# EAGLE design Xonik Noise A6 w.logo v2.0 (EAGLE 9.5.2)
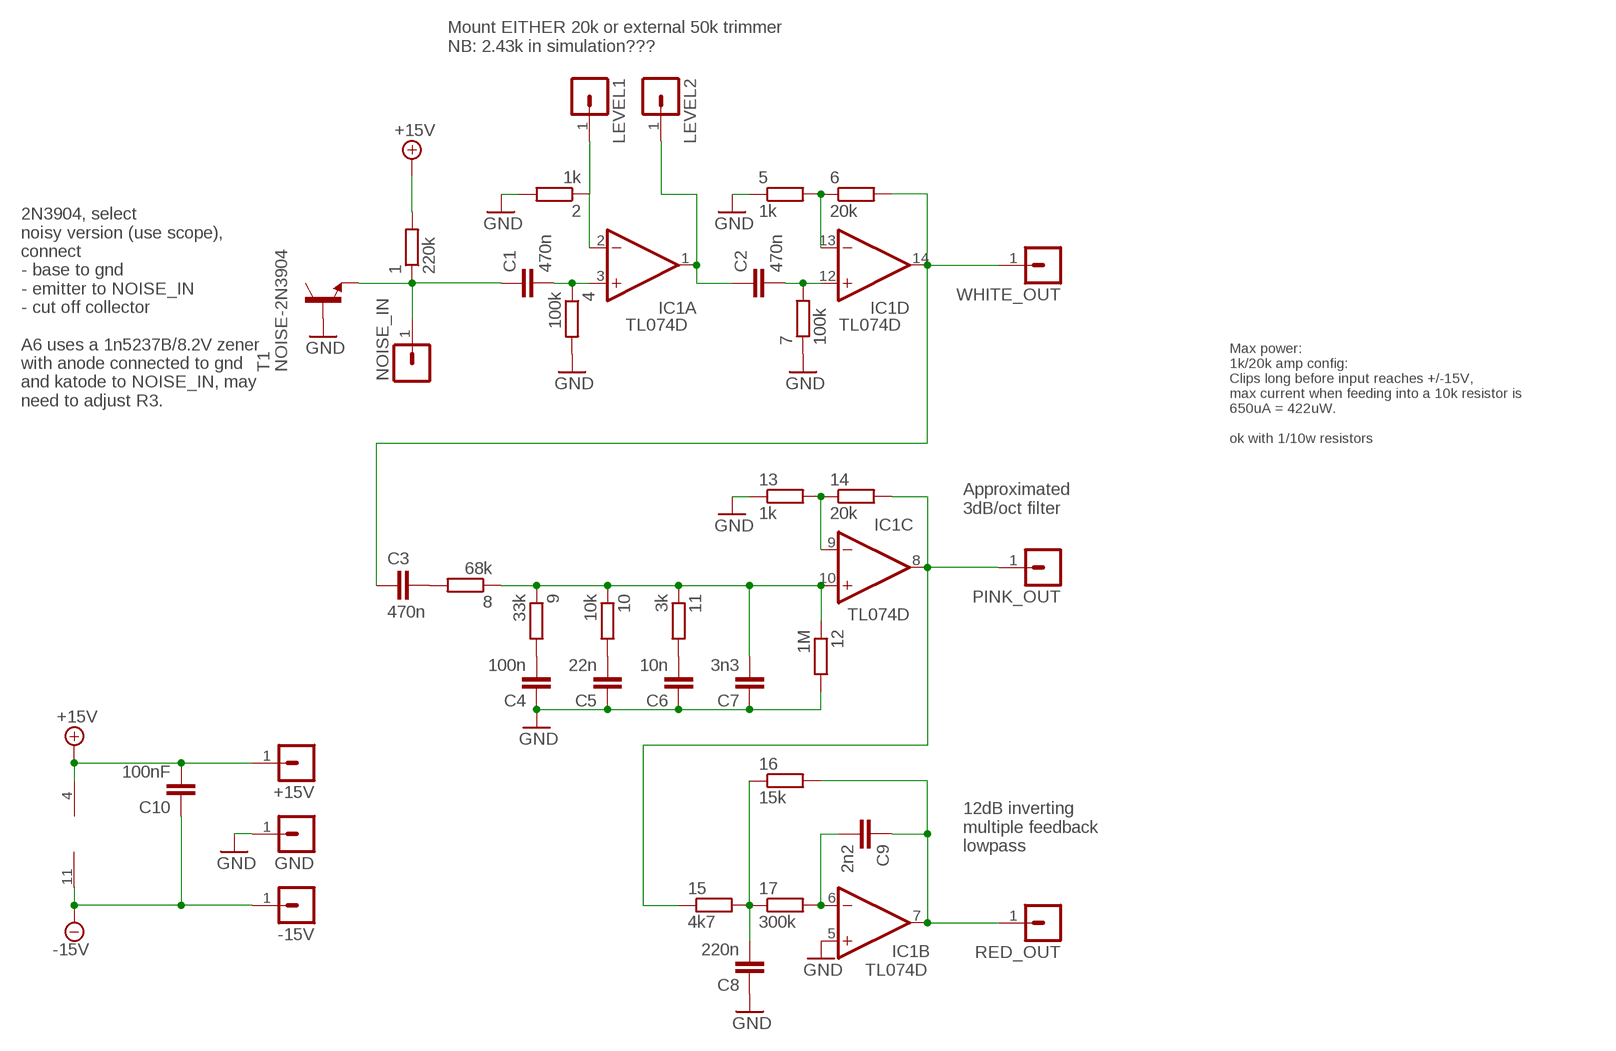
[diagram p0: schematic, sheet 1]

## Parts
1  220k  R-EU_R0805  [R0805]
2  1k  R-EU_R0805  [R0805]
4  100k  R-EU_R0805  [R0805]
5  1k  R-EU_R0805  [R0805]
6  20k  R-EU_R0805  [R0805]
7  100k  R-EU_R0805  [R0805]
8  68k  R-EU_R0805  [R0805]
9  33k  R-EU_R0805  [R0805]
10  10k  R-EU_R0805  [R0805]
11  3k  R-EU_R0805  [R0805]
12  1M  R-EU_R0805  [R0805]
13  1k  R-EU_R0805  [R0805]
14  20k  R-EU_R0805  [R0805]
15  4k7  R-EU_R0805  [R0805]
16  15k  R-EU_R0805  [R0805]
17  300k  R-EU_R0805  [R0805]
+15V  MA01-1JP  [SIP-PIN01-1J]
-15V  MA01-1JP  [SIP-PIN01-1J]
C1  470n  C-EUC0805  [C0805]
C2  470n  C-EUC0805  [C0805]
C3  470n  C-EUC0805  [C0805]
C4  100n  C-EUC0805  [C0805]
C5  22n  C-EUC0805  [C0805]
C6  10n  C-EUC0805  [C0805]
C7  3n3  C-EUC0805  [C0805]
C8  220n  C-EUC0805  [C0805]
C9  2n2  C-EUC0805  [C0805]
C10  100nF  C-EUC0603  [C0603]
GND  MA01-1JP  [SIP-PIN01-1J]
IC1  TL074D  [SO14]
LEVEL1  MA01-1JP  [SIP-PIN01-1J]
LEVEL2  MA01-1JP  [SIP-PIN01-1J]
NOISE_IN  MA01-1JP  [SIP-PIN01-1J]
PINK_OUT  MA01-1JP  [SIP-PIN01-1J]
RED_OUT  MA01-1JP  [SIP-PIN01-1J]
T1  NOISE-2N3904  [NOISE-2N3904-J]
WHITE_OUT  MA01-1JP  [SIP-PIN01-1J]

## Nets
+15V: 1.2 +15V.1 C10.2 IC1.4(P:V+)
-15V: -15V.1 C10.1 IC1.11(P:V-)
GND: 2.2 4.2 5.1 7.1 12.2 13.1 C4.1 C5.1 C6.1 C7.1 C8.1 GND.1 IC1.5(B:+IN) T1.B
N$1: 2.1 IC1.2(A:-IN) LEVEL1.1
N$2: 5.2 6.1 IC1.13(D:-IN)
N$3: 13.2 14.1 IC1.9(C:-IN)
N$4: 9.2 C4.2
N$5: 10.2 C5.2
N$6: 11.2 C6.2
N$7: 1.1 C1.1 NOISE_IN.1 T1.E
N$8: 4.1 C1.2 IC1.3(A:+IN)
N$9: C2.1 IC1.1(A:OUT) LEVEL2.1
N$10: 7.2 C2.2 IC1.12(D:+IN)
N$11: 6.2 C3.1 IC1.14(D:OUT) WHITE_OUT.1
N$12: 8.1 9.1 10.1 11.1 12.1 C7.2 IC1.10(C:+IN)
N$13: 8.2 C3.2
N$14: 14.2 15.1 IC1.8(C:OUT) PINK_OUT.1
N$16: 15.2 16.1 17.1 C8.2
N$17: 17.2 C9.2 IC1.6(B:-IN)
N$18: 16.2 C9.1 IC1.7(B:OUT) RED_OUT.1

## Notes on the sheet
- Mount EITHER 20k or external 50k trimmer
  NB: 2.43k in simulation???
- 2N3904, select
  noisy version (use scope),
  connect 
  - base to gnd
  - emitter to NOISE_IN
  - cut off collector
  
  A6 uses a 1n5237B/8.2V zener
  with anode connected to gnd 
  and katode to NOISE_IN, may
  need to adjust R3.
- Max power:
  1k/20k amp config:
  Clips long before input reaches +/-15V,
  max current when feeding into a 10k resistor is
  650uA = 422uW. 
  
  ok with 1/10w resistors
- Approximated
  3dB/oct filter
- 12dB inverting
  multiple feedback
  lowpass

## Library data of the parts
1 2 4-17 = resistor:R-EU_: RESISTOR, European symbol
+15V -15V GND LEVEL1 LEVEL2 NOISE_IN PINK_OUT RED_OUT WHITE_OUT = joakim:MA01-1J: PIN HEADER
C1-C10 = resistor:C-EU: CAPACITOR, European symbol
IC1 = linear:TL074: OP AMP
T1 = joakim:NOISE-2N3904: 2N3904 with the collector cut, used as a noise source

## Board
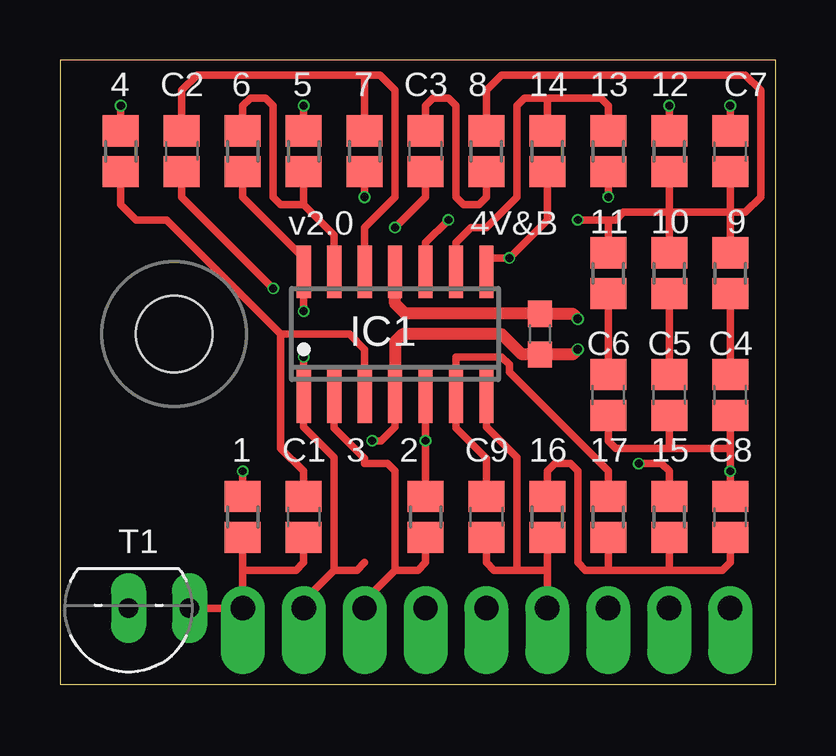
[diagram p1: board, top side]
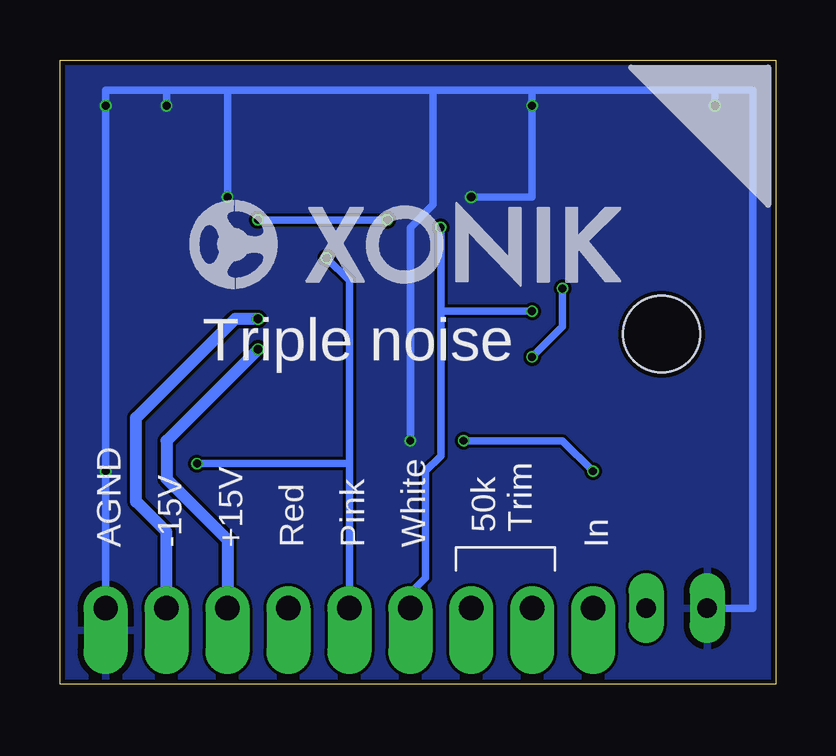
[diagram p2: board, bottom side, seen from below]

Size 29.84 x 26.04 mm. Coordinates in mm from the lower left corner, seen from the top.
Outline: 0,0 29.84,0 29.84,26.04 0,26.04 0,0
Copper layers (1*16): Top 0.035mm / dielectric 1.6mm / Bottom 0.035mm
Design rules "jlcpcb-2layers": minimum track width 5mil, minimum drill 0.3mm, track to track 5mil, track to pad 5mil, pad to pad 5mil, via to via 5mil, smd to smd 5mil, copper to edge 0.2mm, drill to drill 6mil, minimum pad ring 10mil, minimum via ring 3mil, stop-mask expansion 4mil, vias tented up to drill 0mil, thermal gap 10mil
Holes 3.2 mm at 4.76,14.61

### Footprints (pad centres in the part's own frame; a part is rotated, then mirrored left to right if it is on the bottom)
R0805 = smd 1.3 x 1.5: 1 -0.85,0; 2 0.85,0
SIP-PIN01-1J = drill 1.016 offset: 1 0,0
C0805 = smd 1.3 x 1.5: 1 -0.85,0; 2 0.85,0
C0603 = smd 1.1 x 1: 1 -0.85,0; 2 0.85,0
SO14 = smd 0.6 x 2.2: 1 -3.81,-2.6; 2 -2.54,-2.6; 3 -1.27,-2.6; 4 0,-2.6; 5 1.27,-2.6; 6 2.54,-2.6; 7 3.81,-2.6; 8 3.81,2.6; 9 2.54,2.6; 10 1.27,2.6; 11 0,2.6; 12 -1.27,2.6; 13 -2.54,2.6; 14 -3.81,2.6
NOISE-2N3904-J = drill 0.813 long: B 0,0; E -2.54,0

### Placement (x,y rotation side)
1  7.62,6.99 90 top
2  15.24,6.99 90 top
4  2.54,22.23 90 top
5  10.16,22.23 270 top
6  7.62,22.23 270 top
7  12.7,22.23 90 top
8  17.78,22.23 270 top
9  27.94,17.14 270 top
10  25.4,17.14 270 top
11  22.86,17.14 270 top
12  25.4,22.23 90 top
13  22.86,22.23 90 top
14  20.32,22.23 270 top
15  25.4,6.99 270 top
16  20.32,6.99 270 top
17  22.86,6.99 90 top
+15V  22.86,3.17 0 top
-15V  25.4,3.17 0 top
C1  10.16,6.99 90 top
C2  5.08,22.23 90 top
C3  15.24,22.23 90 top
C4  27.94,12.06 90 top
C5  25.4,12.06 90 top
C6  22.86,12.06 90 top
C7  27.94,22.23 270 top
C8  27.94,6.99 270 top
C9  17.78,6.99 90 top
C10  20,14.61 270 top
GND  27.94,3.17 0 top
IC1  13.97,14.61 0 top
LEVEL1  12.7,3.17 0 top
LEVEL2  10.16,3.17 0 top
NOISE_IN  7.62,3.17 0 top
PINK_OUT  17.78,3.17 0 top
RED_OUT  20.32,3.17 0 top
T1  2.86,3.17 180 top
U$1  [XONIK_LOGO_18]  24.45,16.51 0 bottom
WHITE_OUT  15.24,3.17 0 top

### Tracks (layer width: path | path; a pad name or v marks a point on that pad's centre or on a via)
+15V  (via drill 0.33, 0.35)
  Top 0.305: 1.2 v7.62,8.89 | v13.02,10.16 13.39,10.16 13.97,10.73 IC1.4
  Top 0.508: v21.59,13.97 21.38,13.76 C10.2 19.27,13.76 18.41,14.61 14.29,14.61 13.97,14.29 IC1.4
  Bottom 0.305: v7.62,8.89 8.89,10.16 v13.02,10.16
  Bottom 0.508: +15V.1 22.86,6.03 25.4,8.57 25.4,10.16 v21.59,13.97
-15V  (via drill 0.35)
  Top 0.508: IC1.11 13.97,15.88 14.39,15.46 C10.1 21.38,15.46 v21.59,15.24
  Bottom 0.508: -15V.1 25.4,6.35 26.67,7.62 26.67,11.11 22.54,15.24 v21.59,15.24
GND  (via drill 0.33, 0.35)
  Top 0.305: IC1.5 v15.24,10.16 2.2 | v10.16,24.13 5.1 10.16,22.86 | 2.96,23.5 4.2 v2.54,24.13 | 25.18,10.79 25.4,10.79 C5.1 25.4,9.84 | v25.4,24.13 12.2 | 27.94,24.03 C7.1 v27.94,24.13 | v22.86,20.32 13.1 | C4.1 27.94,9.84 | 27.94,9.84 v27.94,8.89 C8.1 | 7.1 v12.7,20.32 | 25.4,9.84 23.18,9.84 22.86,10.16 C6.1 | 27.94,9.84 25.4,9.84
  Bottom 0.305: 10.16,24.77 14.29,24.77 | 14.29,24.77 14.29,20 15.24,19.05 v15.24,10.16 | 10.16,24.77 v10.16,24.13 10.16,20.32 v12.7,20.32 | 10.16,24.77 2.54,24.77 | 14.29,24.77 22.86,24.77 | 22.86,24.77 v22.86,20.32 | 22.86,24.77 25.4,24.77 | GND.1 v27.94,8.89 v27.94,24.13 27.94,24.77 25.4,24.77 | 25.4,24.77 v25.4,24.13 | T1.B 0.95,3.17 0.95,24.77 2.54,24.77 | v2.54,24.13 2.54,24.77
  pour Bottom: -0.64,26.35 -0.64,-0.64 30.48,-0.64 30.48,26.35
N$1
  Top 0.305: IC1.2 11.43,10.69 12.7,9.42 12.7,9.21 13.65,9.21 13.97,8.89 13.97,4.76 | 15.24,6.06 2.1 15.24,5.08 14.92,4.76 13.97,4.76 | LEVEL1.1 12.7,3.49 13.97,4.76
N$2
  Top 0.305: 7.62,22.86 6.1 7.62,24.13 7.94,24.45 8.57,24.45 8.89,24.13 8.89,20.32 9.21,20 10.16,20 | 9.95,21.59 5.2 10.16,20 | IC1.13 11.43,18.73 10.16,20
N$3
  Top 0.305: IC1.9 16.51,18.41 17.14,19.05 17.78,19.05 19.05,20.32 19.05,24.13 19.37,24.45 20.32,24.45 | 20.11,22.86 14.1 | 14.1 20.32,23.5 | 22.44,23.5 13.2 22.86,24.13 22.54,24.45 20.32,24.45 | 14.1 20.32,24.45
N$4
  Top 0.305: C4.2 9.2
N$5
  Top 0.305: C5.2 10.2
N$6
  Top 0.305: C6.2 11.2
N$7
  Top 0.305: 7.62,4.76 NOISE_IN.1 T1.E | 7.62,4.76 1.1 8.04,5.71 | 10.16,5.71 C1.1 10.16,5.08 9.84,4.76 7.62,4.76
N$8
  Top 0.305: 2.54,21.59 4.1 2.54,20 3.17,19.37 4.45,19.37 9.21,14.61 | IC1.3 12.7,13.97 12.06,14.61 9.21,14.61 | C1.2 10.16,8.89 9.21,9.84 9.21,14.61
N$9  (via drill 0.33)
  Top 0.305: 11.43,4.76 10.16,3.49 LEVEL2.1 | v10.16,13.65 IC1.1 10.16,10.73 11.43,9.46 11.43,4.76 | v8.89,16.51 5.08,20.32 C2.1 | 12.7,5.08 12.38,4.76 11.43,4.76
  Bottom 0.305: v10.16,13.65 8.89,14.92 v8.89,16.51
N$10
  Top 0.305: C2.2 5.08,24.77 5.71,25.4 12.7,25.4 | 12.7,25.4 7.2 | IC1.12 12.7,19.05 13.97,20.32 13.97,24.77 13.34,25.4 12.7,25.4
N$11  (via drill 0.33)
  Top 0.305: v10.16,15.56 IC1.14 10.16,17.72 10.1,17.78 10.16,17.78 7.62,20.32 6.2 | C3.1 15.24,20.32 v13.97,19.05
  Bottom 0.305: WHITE_OUT.1 15.24,3.81 14.61,4.45 14.61,8.89 13.97,9.53 13.97,15.56 | 13.97,15.56 v10.16,15.56 | v13.97,19.05 13.97,15.56
N$12  (via drill 0.33)
  Top 0.305: 25.4,19.27 10.1 25.4,19.68 | IC1.10 15.24,18.41 v16.19,19.37 | C7.2 27.94,19.68 | 25.4,19.68 27.94,19.68 | 25.4,20.42 12.1 25.4,19.68 | 25.4,19.68 23.5,19.68 23.18,19.37 22.86,19.37 | 9.1 27.94,19.68 | 27.94,19.68 28.57,19.68 29.21,20.32 29.21,24.77 28.57,25.4 18.41,25.4 17.78,24.77 8.1 | v21.59,19.37 22.86,19.37 | 11.1 22.86,19.37
  Bottom 0.305: v21.59,19.37 v16.19,19.37
N$13
  Top 0.305: C3.2 15.24,22.86 | 15.24,23.5 C3.2 | 17.57,21.59 8.2 17.78,20.32 17.46,20 16.83,20 16.51,20.32 16.51,24.13 16.19,24.45 15.56,24.45 15.24,24.13 C3.2
N$14  (via drill 0.33)
  Top 0.305: 14.2 20.32,19.37 v18.73,17.78 17.78,17.78 IC1.8 17.84,17.14 | 15.1 25.4,8.89 25.08,9.21 v24.13,9.21
  Bottom 0.305: v24.13,9.21 17.78,9.21 | v18.73,17.78 17.78,16.83 17.78,9.21 | PINK_OUT.1 17.78,9.21
N$16
  Top 0.305: 22.86,4.76 17.1 22.64,6.35 | 22.86,4.76 25.48,4.76 25.4,4.8 15.2 25.4,4.76 27.62,4.76 27.94,5.08 C8.2 | 16.1 20.32,8.89 20.64,9.21 21.27,9.21 21.59,8.89 21.59,5.08 21.91,4.76 22.86,4.76
N$17
  Top 0.305: C9.2 17.78,9.42 16.51,10.69 IC1.6 16.51,13.65 18.41,13.65 18.73,13.34 18.73,13.02 22.86,8.89 17.2
N$18
  Top 0.305: 20.22,6.03 16.2 20.32,4.76 | IC1.7 17.78,10.73 19.05,9.46 19.05,4.76 | 17.78,6.03 C9.1 17.78,5.08 18.1,4.76 19.05,4.76 | 20.32,4.76 RED_OUT.1 | 20.32,4.76 19.05,4.76

### Text on the board
tNames: 4 | C2 | 6 | 5 | 7 | C3 | 8 | 14 | 13 | 12 | C7 | v2.0 | 4V&B | 11 | 10 | 9 | IC1 | C6 | C5 | C4 | 1 | C1 | 3 | 2 | C9 | 16 | 17 | 15 | C8 | T1
bNames: Triple noise | In | 50k / Trim | White | Pink | Red | +15V | -15V | AGND